# EAGLE design EXM Relay One - Rev A3 (EAGLE 7.7.0)
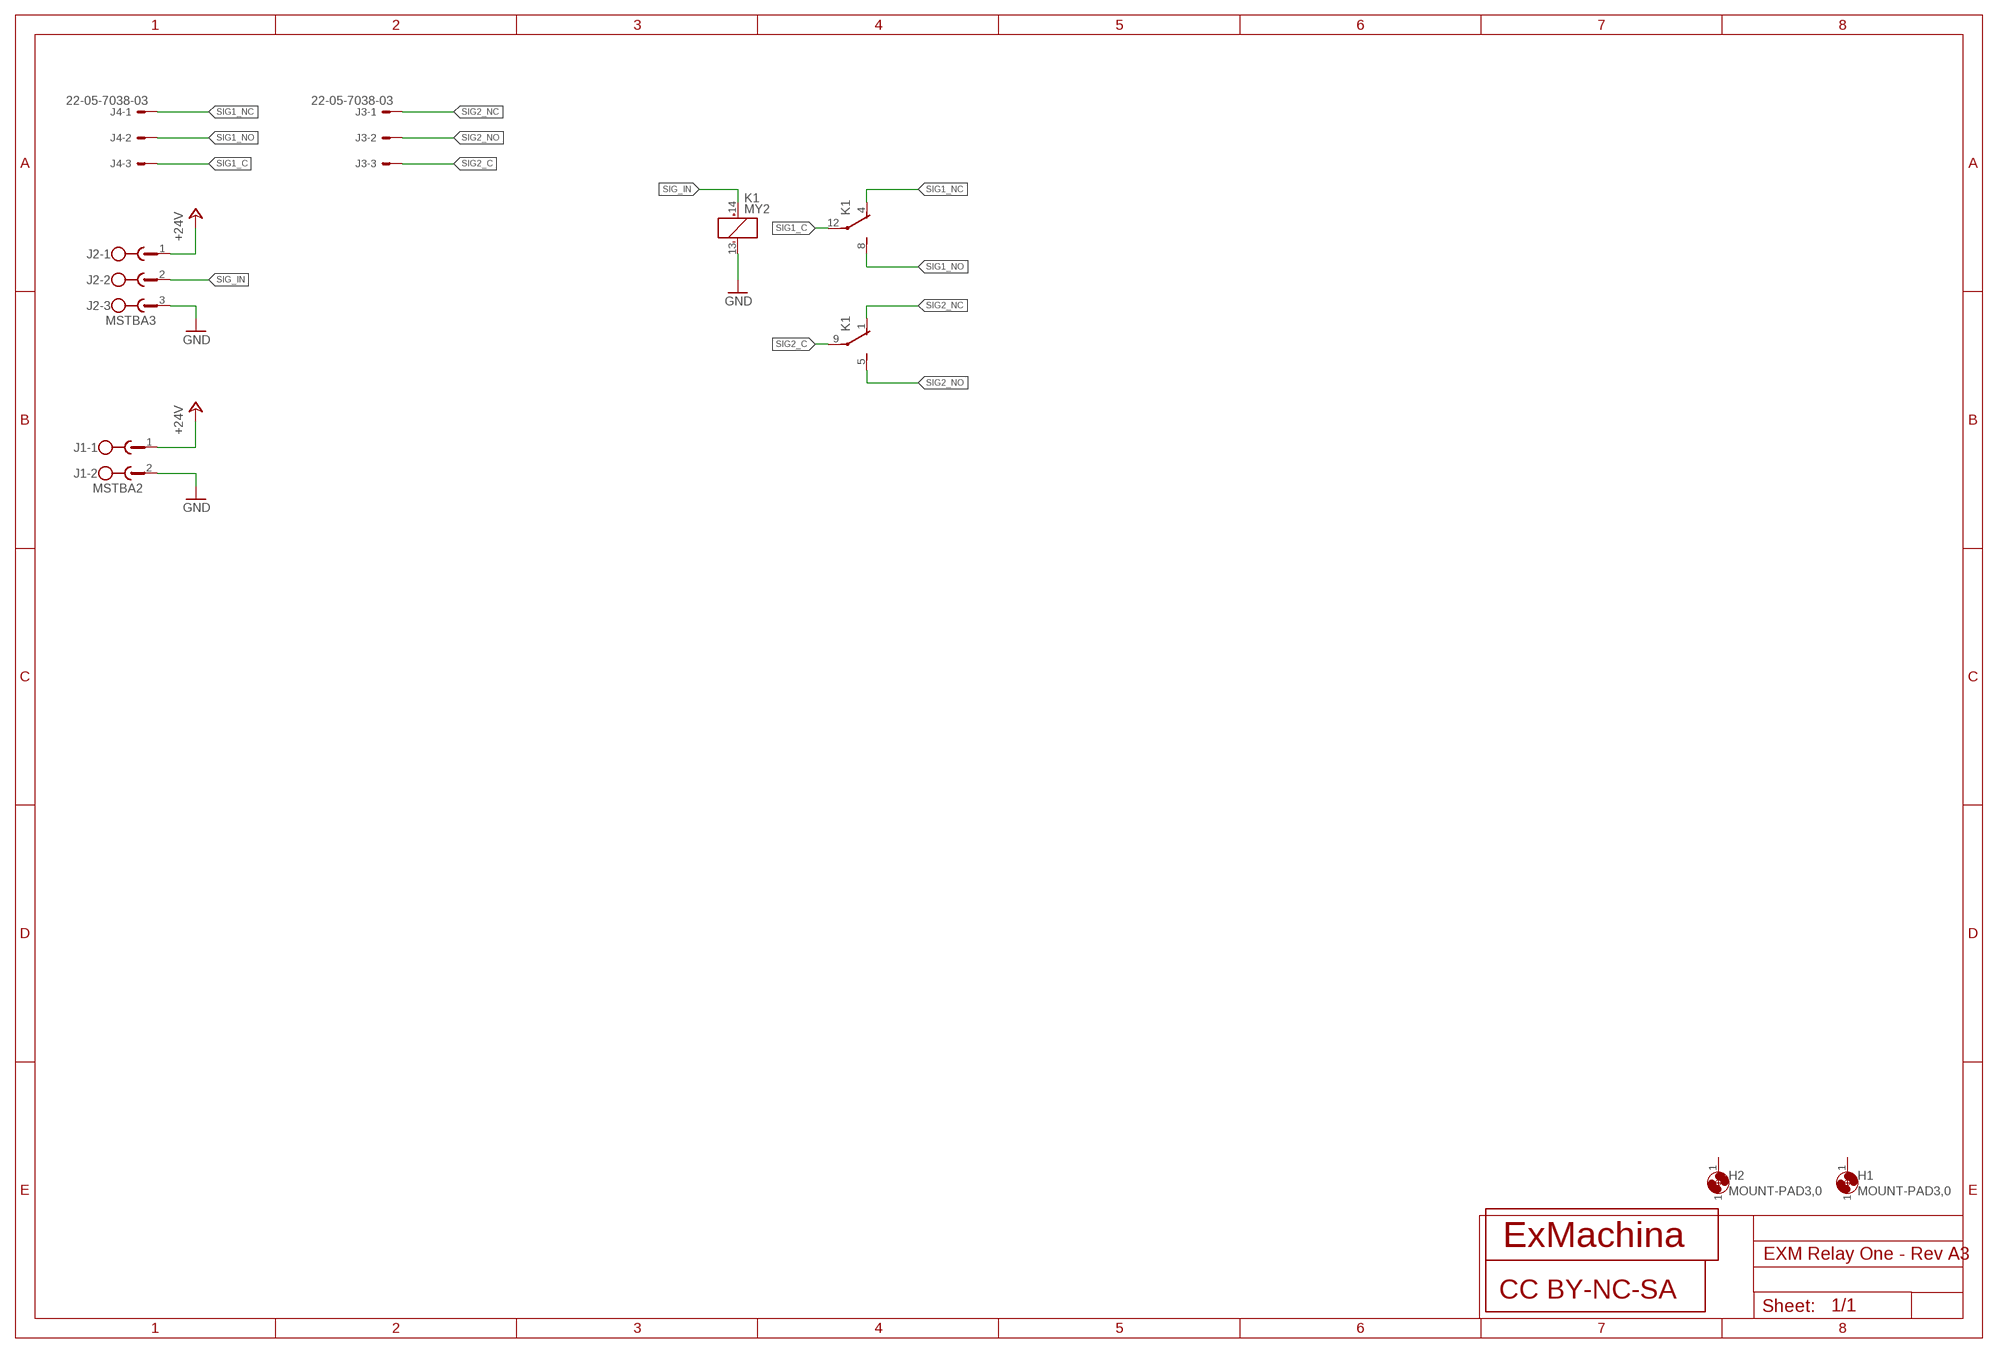
[diagram p0: schematic, sheet 1]

## Parts
CC1  CC-BY-NC-SA  [CC-BY-NC-SA]
H1  MOUNT-PAD3,0  [P3,0]
H2  MOUNT-PAD3,0  [P3,0]
J1  MSTBA2  [MSTBA2]
J2  MSTBA3  [MSTBA3]
J3  22-05-7038-03  [7395-03]
J4  22-05-7038-03  [7395-03]
K1  MY2  [PY08]
T1  EXMACHINA-LOGO-NAME  [EXM-LOGO-BASELINE]

## Nets
+24V: J1.1 J2.1
GND: J1.2 J2.3 K1.13(-)
SIG1_C: J4.3 K1.12(C)
SIG1_NC: J4.1 K1.4(NC)
SIG1_NO: J4.2 K1.8(NO)
SIG2_C: J3.3 K1.9(C)
SIG2_NC: J3.1 K1.1(NC)
SIG2_NO: J3.2 K1.5(NO)
SIG_IN: J2.2 K1.14(+)
Unconnected: H1.1 H2.1

## Library data of the parts
CC1 = cc-by-sa:CC-BY-NC-SA
H1 H2 = holes:MOUNT-PAD: MOUNTING HOLE with drill center marker
J1 = con-phoenix-508:MSTBA2: PHOENIX; MF: FARNELL; MPN: 1757242; OC_FARNELL: 3705171; OC_NEWARK: 71C4161
J2 = con-phoenix-508:MSTBA3: PHOENIX; MF: FARNELL; MPN: 1757255; OC_FARNELL: 3705183; OC_NEWARK: 71C4162
J3 J4 = con-molex:22-?-03: CONNECTOR wire to board 2.54 mm (.1 inch) pitch header; OC_FARNELL: 9731610; OC_NEWARK: unknown
K1 = rel-omron:MY2
T1 = exmachina:EXMACHINA-LOGO

## Net classes
0 default: width 0.813 mm

## Board
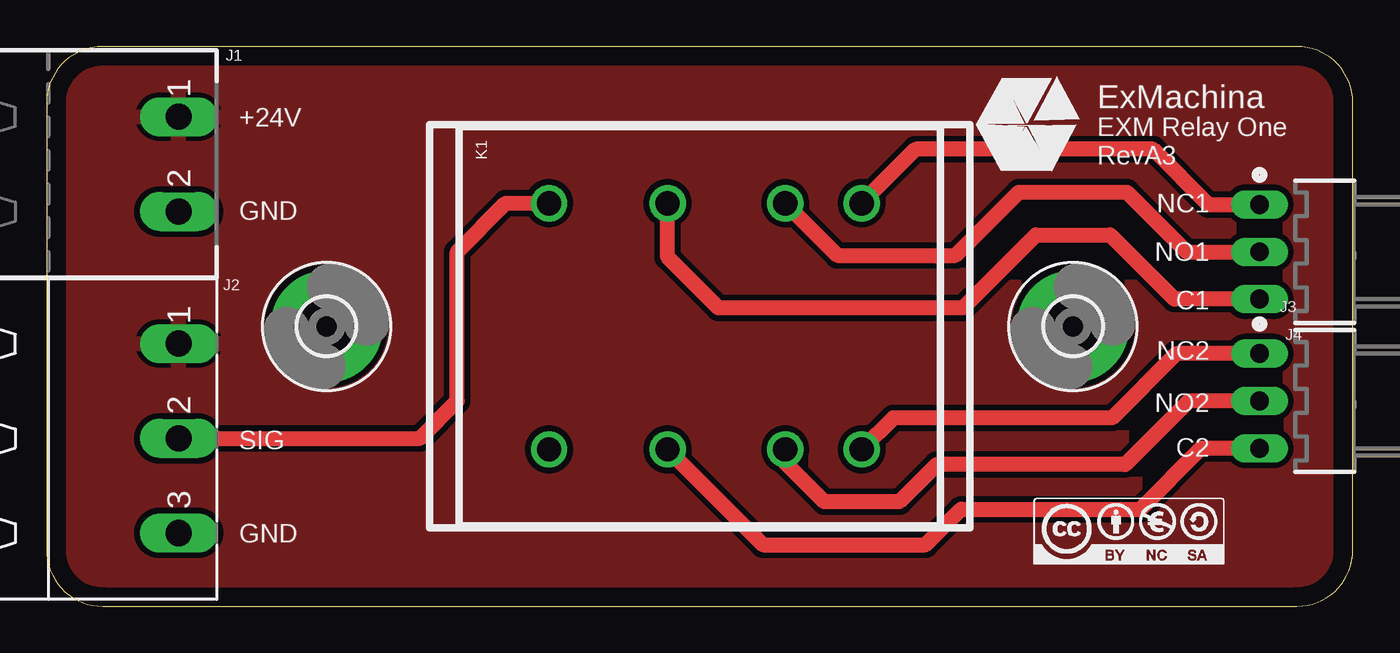
[diagram p1: board, top side]
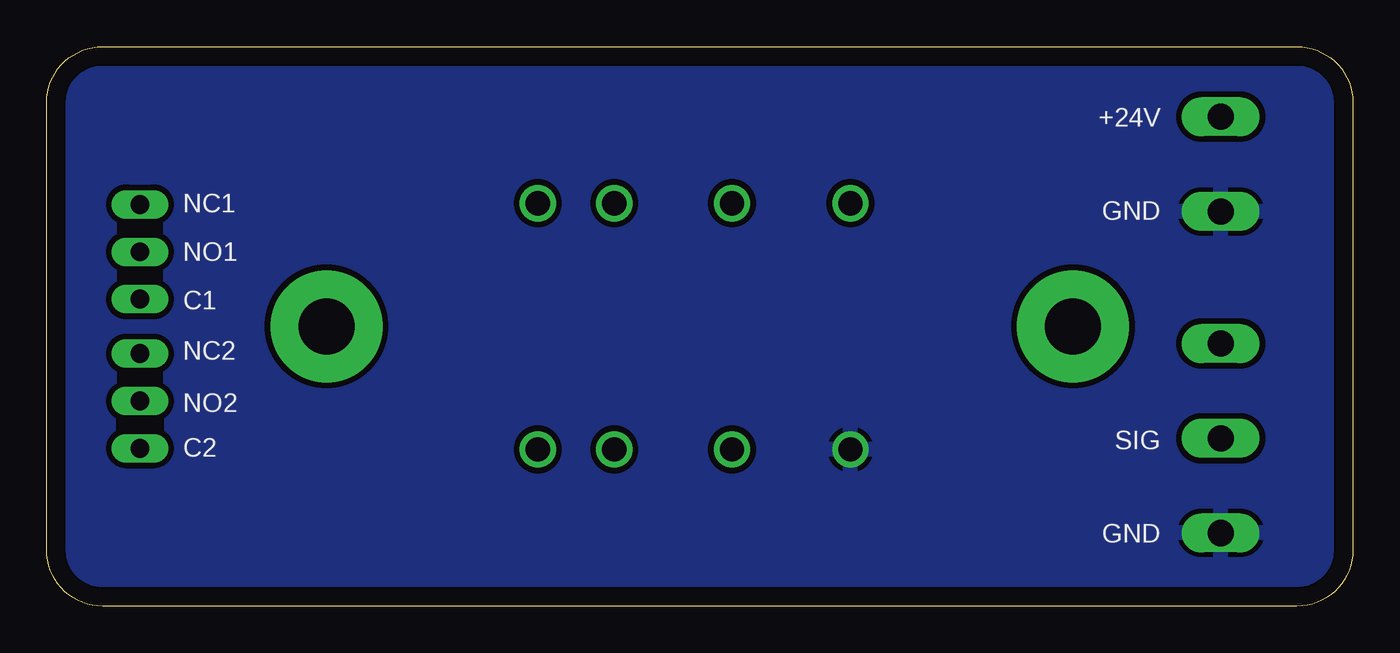
[diagram p2: board, bottom side, seen from below]

Size 70 x 30 mm. Coordinates in mm from the lower left corner, seen from the top.
Outline: 0,27 0,3 arc90 3,0 67,0 arc90 70,3 70,27 arc90 67,30 3,30 arc90 0,27
Copper layers (1*16): Top 0.035mm / dielectric 1.5mm / Bottom 0.035mm
Design rules "default *": minimum track width 10mil, minimum drill 0.6mm, track to track 8mil, track to pad 8mil, pad to pad 8mil, via to via 8mil, smd to smd 8mil, copper to edge 40mil, drill to drill 8mil, minimum pad ring 10mil, minimum via ring 8mil, stop-mask expansion 4mil, vias tented up to drill 0mil, thermal gap 10mil

### Footprints (pad centres in the part's own frame; a part is rotated, then mirrored left to right if it is on the bottom)
P3,0 = drill 3 pad 6: 1 0,0
MSTBA2 = drill 1.397 long: 1 -2.54,5.08; 2 2.54,5.08
MSTBA3 = drill 1.397 long: 1 -5.08,5.08; 2 0,5.08; 3 5.08,5.08
7395-03 = drill 1.016 long: 1 2.54,0; 2 0,0; 3 -2.54,0
PY08 = drill 1.3: 1 6.595,8.675; 4 -6.605,8.675; 5 6.595,4.575; 8 -6.605,4.575; 9 6.595,-1.725; 12 -6.605,-1.725; 13 6.595,-8.075; 14 -6.605,-8.075

### Placement (x,y rotation side)
CC1  58,4 0 top
H1  15,15 0 top
H2  55,15 0 top
J1  2,23.7 270 top
J2  2,9 270 top
J3  65,11 90 top
J4  65,19 90 top
K1  35,15 270 top
T1  52.5,25.8 0 top
U$1  [A4L-LOC]  -87,-63 0 top  (outside the outline)

### Tracks (layer width: path | path; a pad name or v marks a point on that pad's centre or on a via)
+24V
  pour Top (isolate 0.305): -15,45 103,45 103,-21 -15,-21
GND
  pour Bottom (isolate 0.305): -13,43 101,43 101,25 101,-20 59,-20 -13,-20
SIG1_C
  Top 0.813: J4.3 60.44,16.46 57,19.9 53,19.9 49.1,16 36,16 33.27,18.73 K1.12
SIG1_NC
  Top 0.813: K1.4 46.57,24.5 59.3,24.5 62.26,21.54 J4.1
SIG1_NO
  Top 0.813: K1.8 42.38,18.8 48.7,18.8 52.1,22.2 57.9,22.2 61.1,19 J4.2
SIG2_C
  Top 0.813: J3.3 61.86,8.46 58.6,5.2 49,5.2 47.1,3.3 38.38,3.3 K1.9
SIG2_NC
  Top 0.813: J3.1 60.54,13.54 57.1,10.1 45.37,10.1 K1.1
SIG2_NO
  Top 0.813: J3.2 61.2,11 57.8,7.6 47.7,7.6 45.7,5.6 41.68,5.6 39.58,7.71 K1.5
SIG_IN
  Top 0.813: J2.2 20,9 22,11 22,19 24.61,21.61 K1.14

### Text on the board
tPlace: +24V | EXM Relay One / RevA3 | NC1 | GND | NO1 | C1 | NC2 | NO2 | SIG | C2 | GND
bPlace: +24V | NC1 | GND | NO1 | C1 | NC2 | NO2 | SIG | C2 | GND